# EAGLE design IR_ID (EAGLE 8.4.1)
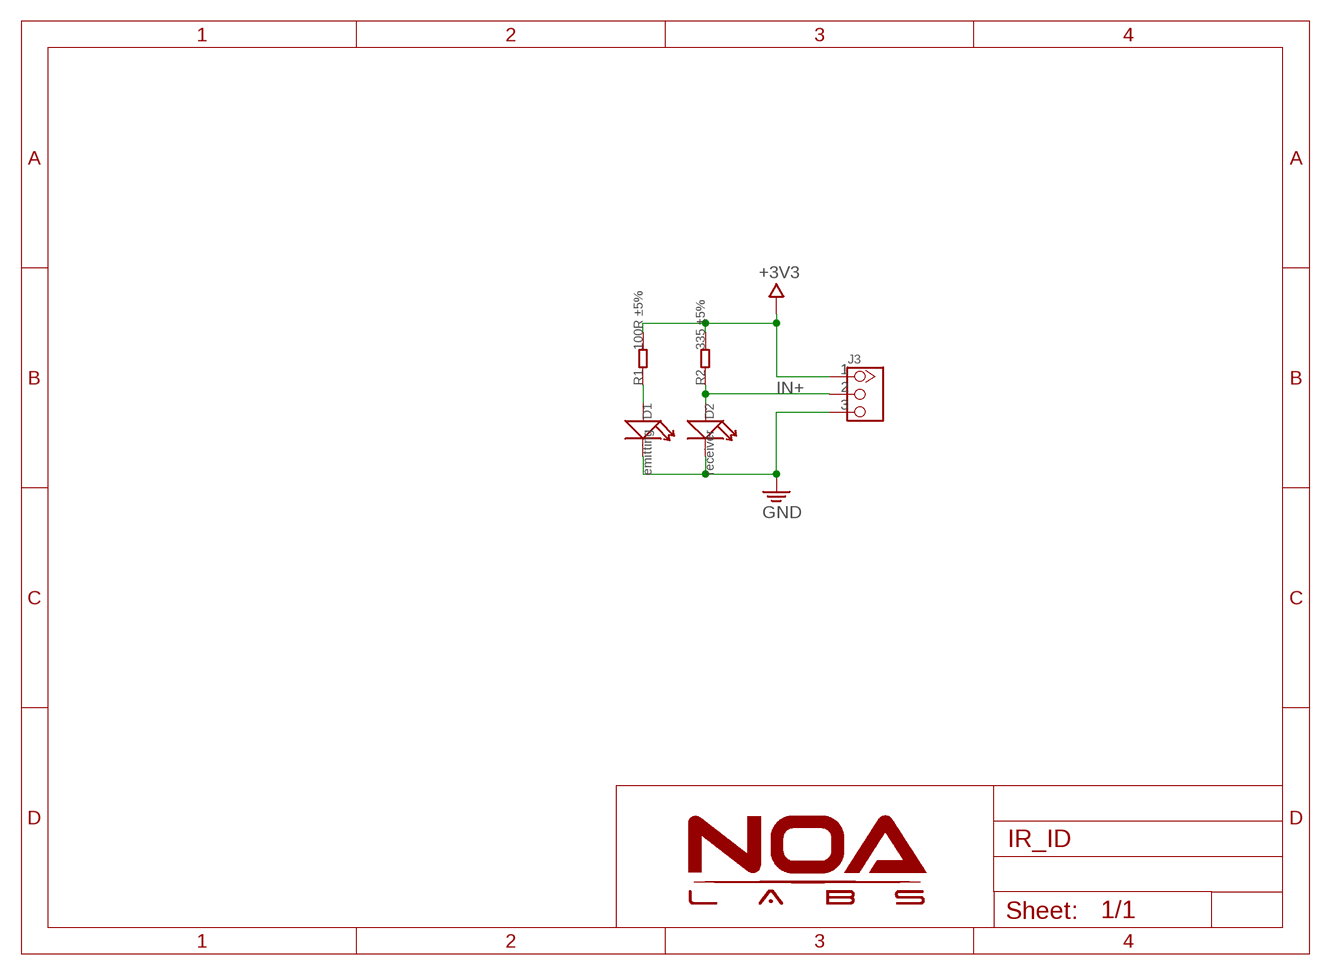
[diagram p0: schematic, sheet 1]

## Parts
D1  emitting  LED-6MM  [LED-2P-2.54-6MM]
D2  receiver  LED-6MM  [LED-2P-2.54-6MM]
J3  HEADER-3P-2.54  [3P-2.54]
R1  100R ±5%  R-0402  [0402]
R2  335 ±5%  R-0402  [0402]

## Nets
+3V3: J3.1 R1.2 R2.2
GND: D1.- D2.- J3.3
IN+: D2.+ J3.2 R2.1
N$2: D1.+ R1.1

## Library data of the parts
D1 D2 = Discrete:LED*
J3 = Connector:HEADER-3P
R1 R2 = Discrete:R*

## Board
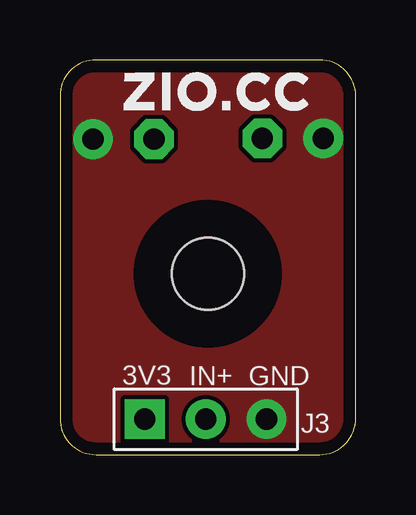
[diagram p1: board, top side]
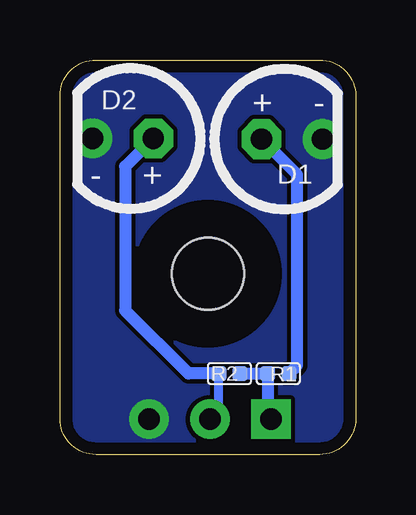
[diagram p2: board, bottom side, seen from below]

Size 12.32 x 16.46 mm. Coordinates in mm from the lower left corner, seen from the top.
Outline: 0,14.96 0,1.5 arc90 1.5,0 10.82,0 arc90 12.32,1.5 12.32,14.96 arc90 10.82,16.46 1.5,16.46 arc90 0,14.96
Copper layers (1*16): Top 0.035mm / dielectric 1.5mm / Bottom 0.035mm
Design rules "NOA Eagle Rule": minimum track width 7mil, minimum drill 12mil, track to track 7mil, track to pad 7mil, pad to pad 7mil, via to via 7mil, smd to smd 0mil, copper to edge 20mil, drill to drill 10mil, minimum pad ring 10mil, minimum via ring 6mil, stop-mask expansion 2mil, vias tented up to drill 25mil, thermal gap 10mil
Holes 3 mm at 6.16,7.54
tRestrict: area 3.2,4.5 to 9.2,10.5
bRestrict: area 3.2,4.5 to 9.2,10.5

### Footprints (pad centres in the part's own frame; a part is rotated, then mirrored left to right if it is on the bottom)
LED-2P-2.54-6MM = drill 0.889 pad 1.651 octagon: + -1.27,0 | drill 0.889 pad 1.651: - 1.27,0
3P-2.54 = drill 0.889 pad 1.651 square: 1 0,2.54 | drill 0.889 pad 1.651: 2 0,0; 3 0,-2.54
0402 = smd 0.635 x 0.635: 1 -0.445,0; 2 0.445,0

### Placement (x,y rotation side)
D1  2.65,13.16 0 bottom
D2  9.7,13.18 180 bottom
J3  6.07,1.47 90 top
R1  3.23,3.38 180 bottom
R2  5.26,3.38 0 bottom
U$1  [1.5MM]  2.51,14.17 0 top

### Tracks (layer width: path | path; a pad name or v marks a point on that pad's centre or on a via)
+3V3
  Bottom 0.508: R2.2 R1.2 3.67,1.61 J3.1
GND
  pour Top (no thermals): 0,16.48 0,0.03 12.34,0.03 12.34,16.48
  pour Bottom (no thermals): 0,16.46 0,0.03 12.32,0.03 12.32,16.46
IN+
  Bottom 0.381: R2.1 5.7,1.84 J3.2
  Bottom 0.508: R2.1 6.96,3.38 9.6,6.02 9.6,12.01 D2.+
N$2
  Bottom 0.508: D1.+ 2.44,11.68 2.44,3.72 R1.1

### Text on the board
tPlace: 3V3 | IN+ | GND